# Altium schematic sheet CAN_PHY.SchDoc
size 420 x 297 mm; SheetNumber: 21; SheetTotal: 34
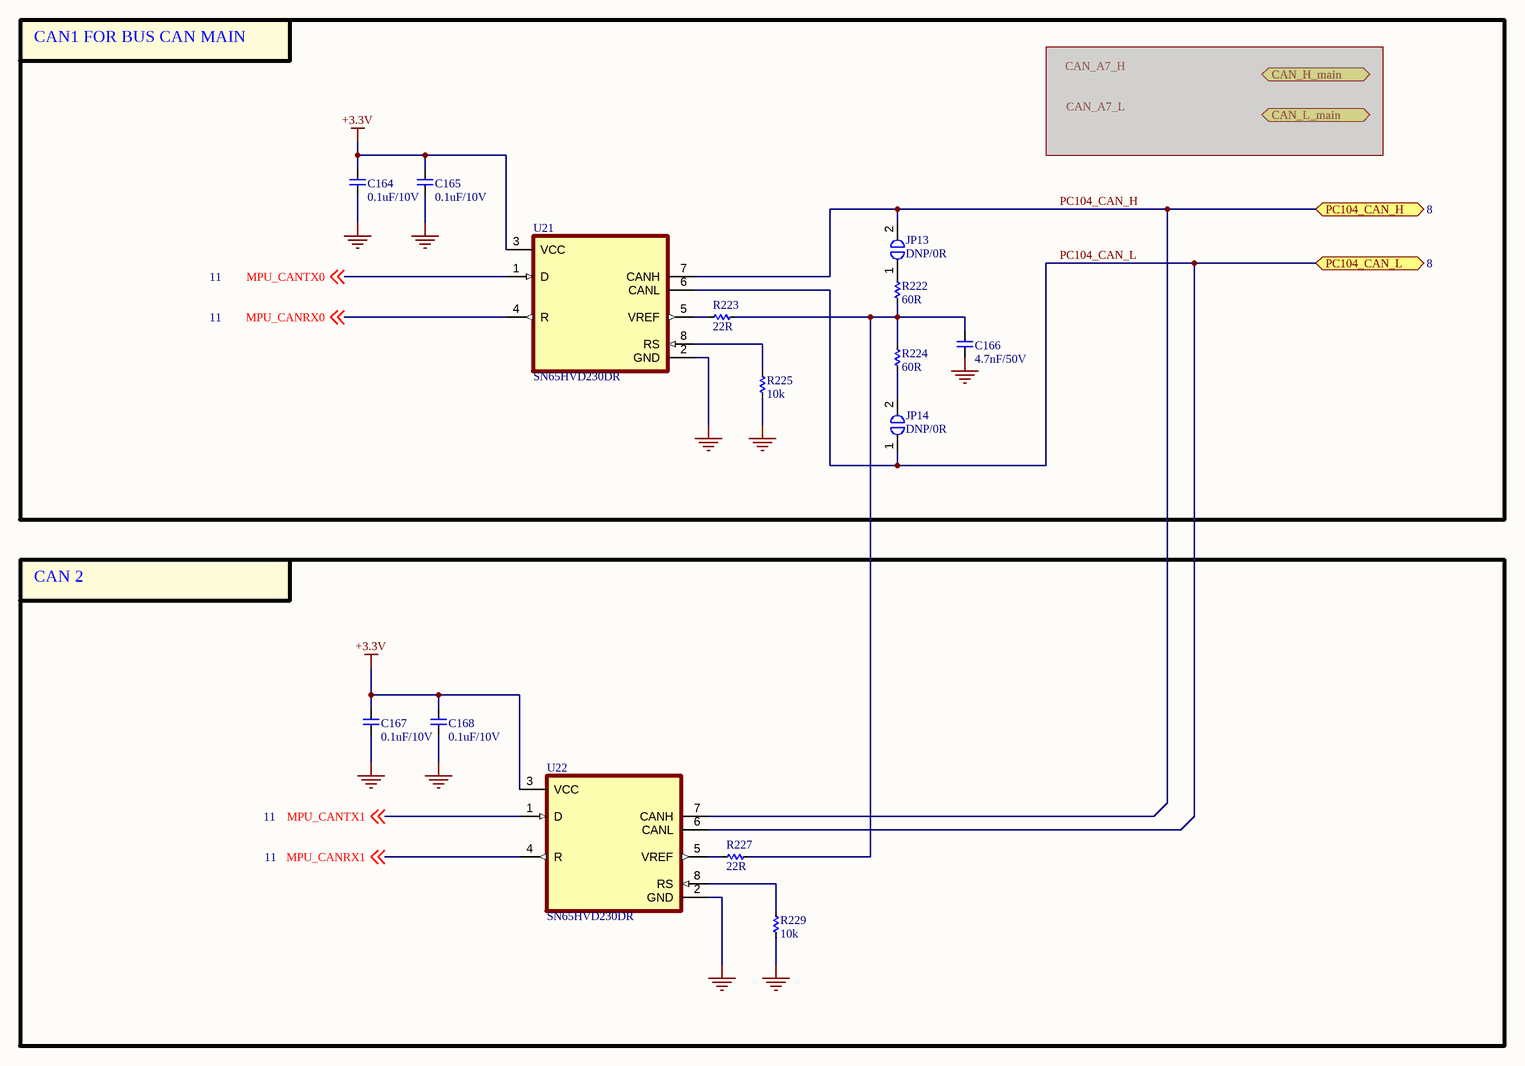
[diagram p0: CAN_PHY.SchDoc]

## Parts
C164  0.1uF/10V  [CAP_C_1005X50_L]
C165  0.1uF/10V  [CAP_C_1005X50_L]
C166  4.7nF/50V  [CAP_C_1608X80]
C167  0.1uF/10V  [CAP_C_1005X50_L]
C168  0.1uF/10V  [CAP_C_1005X50_L]
JP13  DNP/0R  [RES_C_1608X60]
JP14  DNP/0R  [RES_C_1608X60]
R222  60R  [RES_C_1005x30_L]
R223  22R  [RES_C_1005x30_L]
R224  60R  [RES_C_1005x30_L]
R225  10k  [RES_C_1005x30_L]
R227  22R  [RES_C_1005x30_L]
R229  10k  [RES_C_1005x30_L]
U21  SN65HVD230DR  [SOIC127P602X173-8N]
U22  SN65HVD230DR  [SOIC127P602X173-8N]

## Blocks framed on the sheet
CAN1 FOR BUS CAN MAIN: C164-C166 JP13 JP14 R222-R225 U21
CAN 2: C167 C168 R227 R229 U22

## Ports
CAN_H_main (bidir, see CAN_PHY[5A], CONNECTOR_EXP[4B], CONNECTOR_INTERFACE[4A]), CAN_L_main (bidir, see CAN_PHY[5A], CONNECTOR_EXP[4B], CONNECTOR_INTERFACE[4A]), PC104_CAN_H (bidir, see 8), PC104_CAN_L (bidir, see 8)

## Nets
+3.3V: C164.2 C165.2 C167.2 C168.2 U21.3(VCC) U22.3(VCC)
GND: C164.1 C165.1 C166.1 C167.1 C168.1 R225.2 R229.2 U21.2(GND) U22.2(GND)
MPU_CANRX0: U21.4(R) ; off-sheet MPU_CANRX0
MPU_CANRX1: U22.4(R) ; off-sheet MPU_CANRX1
MPU_CANTX0: U21.1(D) ; off-sheet MPU_CANTX0
MPU_CANTX1: U22.1(D) ; off-sheet MPU_CANTX1
PC104_CAN_H: JP13.2 U21.7(CANH) U22.7(CANH) ; port PC104_CAN_H
PC104_CAN_L: JP14.1 U21.6(CANL) U22.6(CANL) ; port PC104_CAN_L
NetC166_2: C166.2 R222.2 R223.1 R224.1 R227.1
NetJP13_1: JP13.1 R222.1
NetJP14_2: JP14.2 R224.2
NetR223_2: R223.2 U21.5(VREF)
NetR225_1: R225.1 U21.8(RS)
NetR227_2: R227.2 U22.5(VREF)
NetR229_1: R229.1 U22.8(RS)

## Notes on the sheet
- Project:
- Sub-system:
- Design by:
- Sheet title:
- Sheet
- of
- Checked by:
- Approved by:
- Revision:
- Document No:
- Size:
- Date:
- A3

## Library data of the parts
C164-C168 = _CAP_C_2: CAP
JP13 JP14 = JUMPER_1_1
R222-R225 R227 R229 = _RES_B_2: RES
U21 U22 = SN65HVD230DR: 3.3 V CAN Transceiver with Standby Mode; MF: Texas Instruments; SnapEDA_Link: https://www.snapeda.com/parts/SN65HVD230DR/Texas+Instruments/view-part/?ref=snap; Package: SOIC-8 Texas Instruments; Value: *; MP: SN65HVD230DR; Check_prices: https://www.snapeda.com/parts/SN65HVD230DR/Texas+Instruments/view-part/?ref=eda